# Altium schematic sheet YYB_2015.SchDoc
size A3
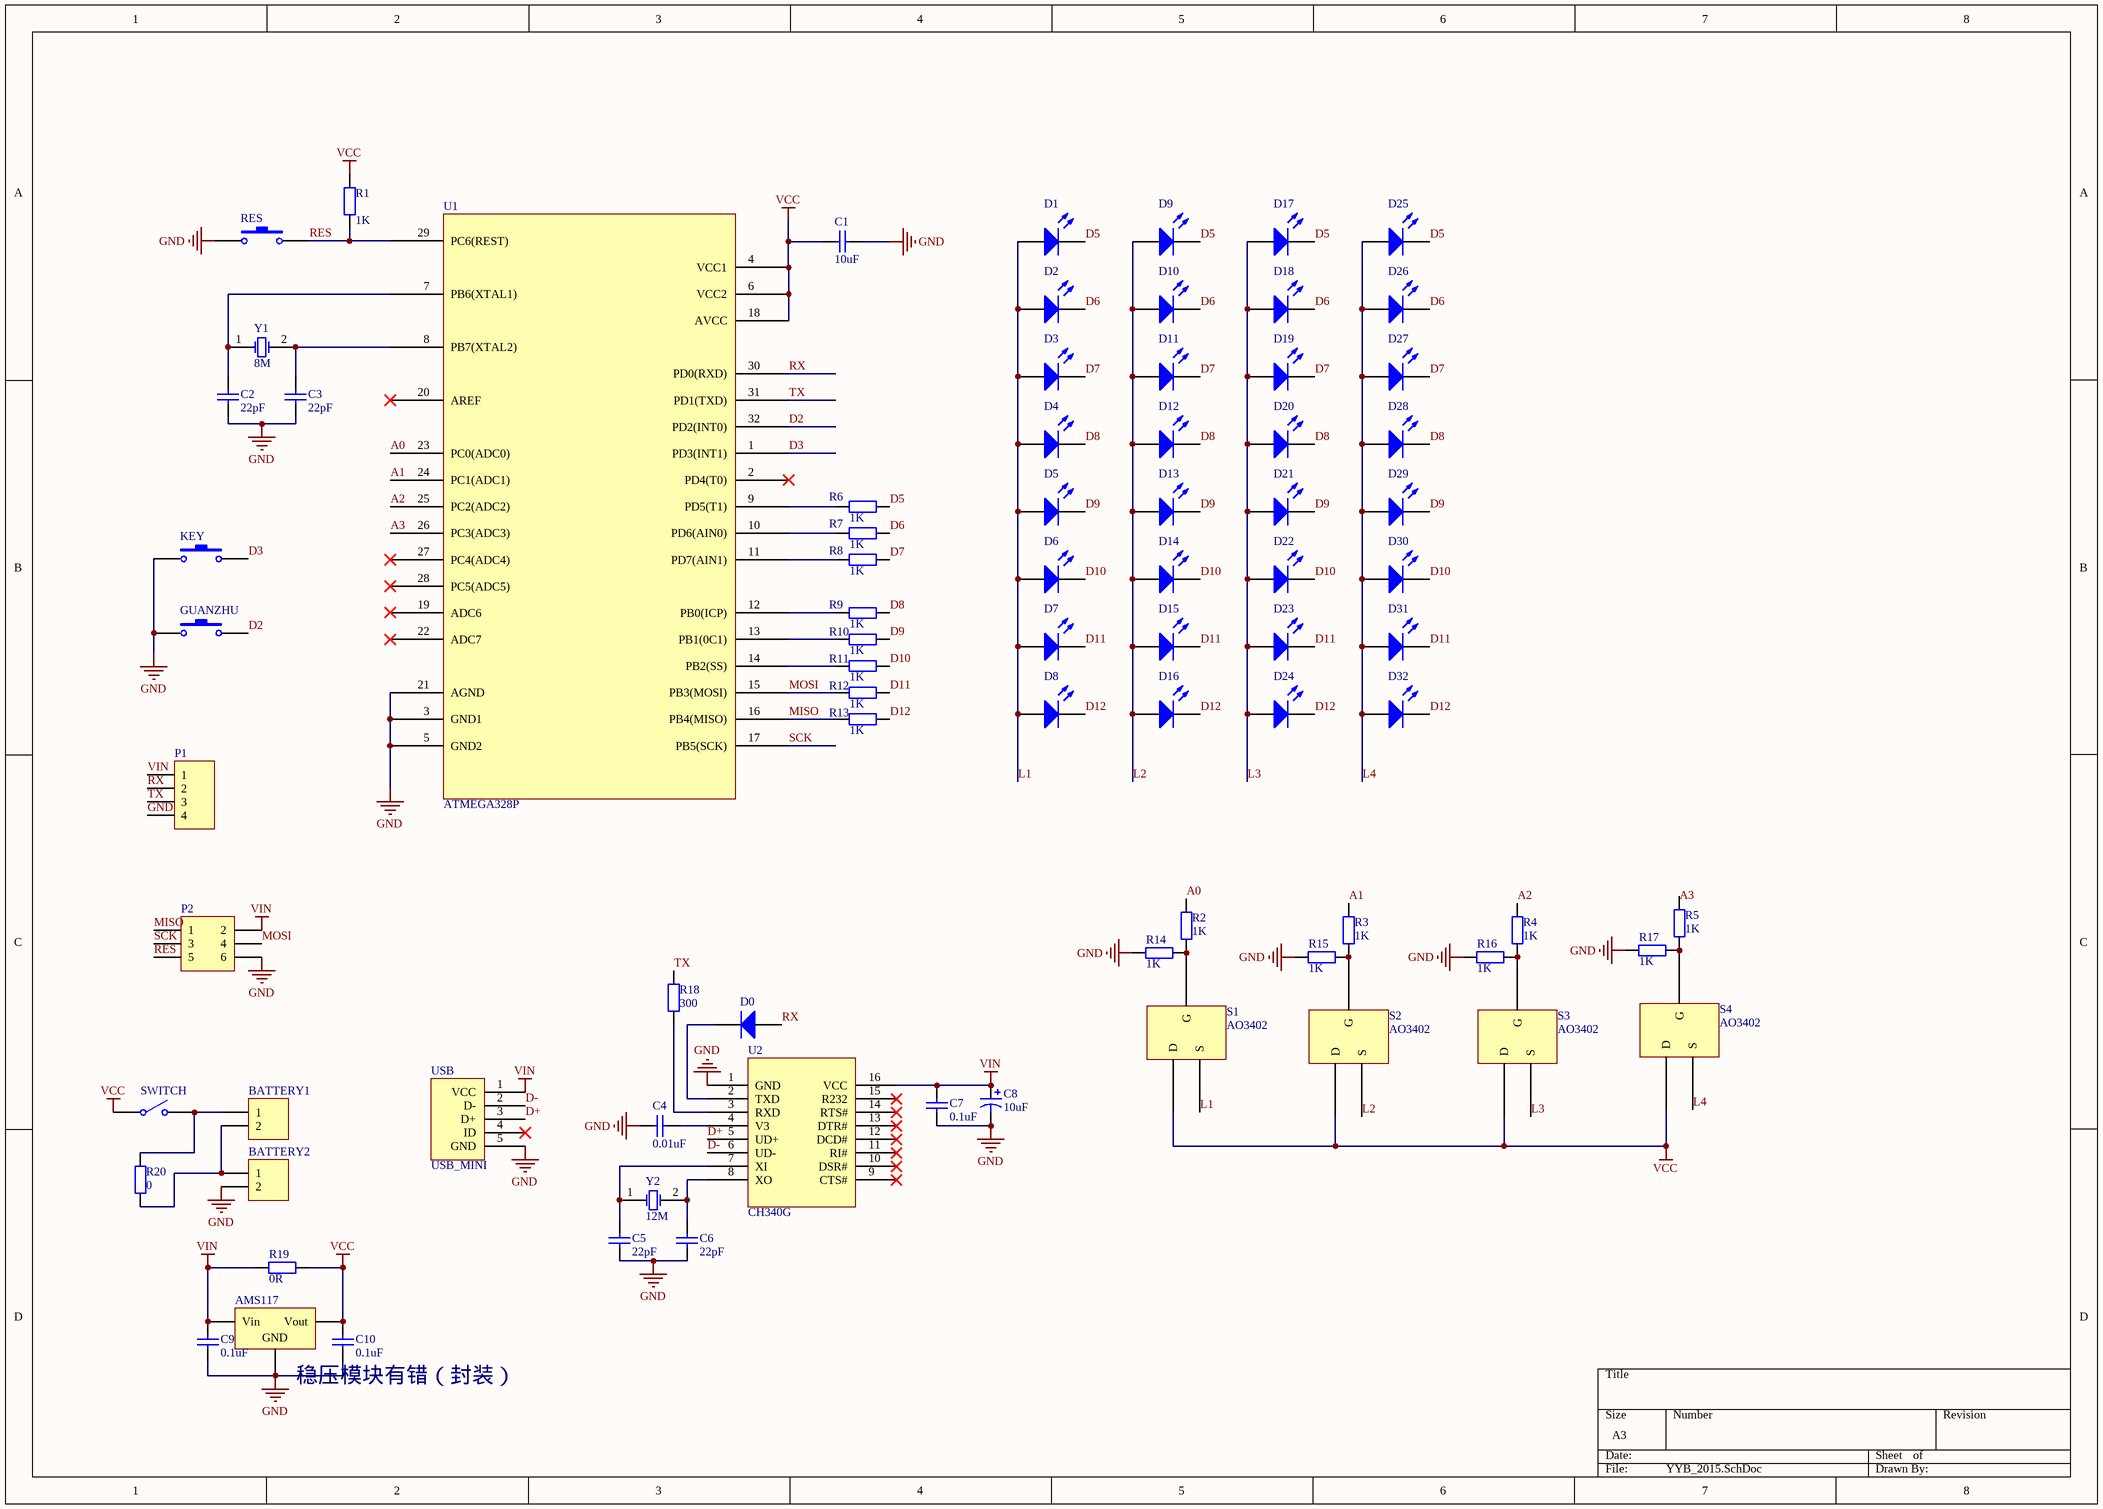
[diagram p0: YYB_2015.SchDoc]

## Parts
AMS117  AMS117  [SOT223_M]  (value not drawn)
BATTERY1  Header 2  [PCBComponent_1 - duplicate1]  (value not drawn)
BATTERY2  Header 2  [PCBComponent_1 - duplicate1]  (value not drawn)
C1  value 10uF  [RES_0603]  (hidden comment: Cap)
C2  value 22pF  [RES_0603]  (hidden comment: Cap)
C3  value 22pF  [RES_0603]  (hidden comment: Cap)
C4  value 0.01uF  [RES_0603]  (hidden comment: Cap)
C5  value 22pF  [RES_0603]  (hidden comment: Cap)
C6  value 22pF  [RES_0603]  (hidden comment: Cap)
C7  value 0.1uF  [RES_0603]  (hidden comment: Cap)
C8  value 10uF  [10uf]  (hidden comment: Cap Pol1)
C9  value 0.1uF  [RES_0603]  (hidden comment: Cap)
C10  value 0.1uF  [RES_0603]  (hidden comment: Cap)
D0  Diode 1N4003  [MBR0520]  (value not drawn)
D1  LED0  [LED1210]  (value not drawn)
D2  LED0  [LED1210]  (value not drawn)
D3  LED0  [LED1210]  (value not drawn)
D4  LED0  [LED1210]  (value not drawn)
D5  LED0  [LED1210]  (value not drawn)
D6  LED0  [LED1210]  (value not drawn)
D7  LED0  [LED1210]  (value not drawn)
D8  LED0  [LED1210]  (value not drawn)
D9  LED0  [LED1210]  (value not drawn)
D10  LED0  [LED1210]  (value not drawn)
D11  LED0  [LED1210]  (value not drawn)
D12  LED0  [LED1210]  (value not drawn)
D13  LED0  [LED1210]  (value not drawn)
D14  LED0  [LED1210]  (value not drawn)
D15  LED0  [LED1210]  (value not drawn)
D16  LED0  [LED1210]  (value not drawn)
D17  LED0  [LED1210]  (value not drawn)
D18  LED0  [LED1210]  (value not drawn)
D19  LED0  [LED1210]  (value not drawn)
D20  LED0  [LED1210]  (value not drawn)
D21  LED0  [LED1210]  (value not drawn)
D22  LED0  [LED1210]  (value not drawn)
D23  LED0  [LED1210]  (value not drawn)
D24  LED0  [LED1210]  (value not drawn)
D25  LED0  [LED1210]  (value not drawn)
D26  LED0  [LED1210]  (value not drawn)
D27  LED0  [LED1210]  (value not drawn)
D28  LED0  [LED1210]  (value not drawn)
D29  LED0  [LED1210]  (value not drawn)
D30  LED0  [LED1210]  (value not drawn)
D31  LED0  [LED1210]  (value not drawn)
D32  LED0  [LED1210]  (value not drawn)
GUANZHU  SW-PB  [GUNZHU]  (value not drawn)
KEY  SW-PB  [KEY]  (value not drawn)
P1  Header 4  [HDR1X4]  (value not drawn)
P2  Header 3X2  [HDR2X3]  (value not drawn)
R1  value 1K  [RES_0603]  (hidden comment: Res2)
R2  value 1K  [RES_0603]  (hidden comment: Res2)
R3  value 1K  [RES_0603]  (hidden comment: Res2)
R4  value 1K  [RES_0603]  (hidden comment: Res2)
R5  value 1K  [RES_0603]  (hidden comment: Res2)
R6  value 1K  [RES_0603]  (hidden comment: Res2)
R7  value 1K  [RES_0603]  (hidden comment: Res2)
R8  value 1K  [RES_0603]  (hidden comment: Res2)
R9  value 1K  [RES_0603]  (hidden comment: Res2)
R10  value 1K  [RES_0603]  (hidden comment: Res2)
R11  value 1K  [RES_0603]  (hidden comment: Res2)
R12  value 1K  [RES_0603]  (hidden comment: Res2)
R13  value 1K  [RES_0603]  (hidden comment: Res2)
R14  value 1K  [RES_0603]  (hidden comment: Res2)
R15  value 1K  [RES_0603]  (hidden comment: Res2)
R16  value 1K  [RES_0603]  (hidden comment: Res2)
R17  value 1K  [RES_0603]  (hidden comment: Res2)
R18  value 300  [RES_0603]  (hidden comment: Res2)
R19  value 0R  [RES_0603]  (hidden comment: Res2)
R20  value 0  [RES_0603]  (hidden comment: Res2)
RES  SW-PB  [KEY]  (value not drawn)
S1  AO3402  [SOT23_M]
S2  AO3402  [SOT23_M]
S3  AO3402  [SOT23_M]
S4  AO3402  [SOT23_M]
SWITCH  SW-SPST  [SPST-2]  (value not drawn)
U1  ATMEGA328P  [328p]
U2  CH340G  [SO-16_N]
USB  USB_MINI  [USB_Micro]
Y1  8M  [XTAL_8M]
Y2  12M  [XTAL32_25]

## Nets
GND: AMS117.2(GND) BATTERY2.2 C1.2 C2.1 C3.1 C4.2 C5.1 C6.1 C7.1 C8.2 C9.1 C10.1 GUANZHU.1 KEY.1 P1.4 P2.6 R14.2 R15.2 R16.2 R17.2 RES.1 U1.3(GND1) U1.5(GND2) U1.21(AGND) U2.1(GND) USB.5(GND)
VCC: AMS117.3(Vout) C1.1 C10.2 R1.2 R19.2 S1.1(D) S2.1(D) S3.1(D) S4.1(D) SWITCH.1(COMMON) U1.4(VCC1) U1.6(VCC2) U1.18(AVCC)
VIN: AMS117.1(Vin) C7.2 C8.1 C9.2 P1.1 P2.2 R19.1 U2.16(VCC) USB.1(VCC)
A0: R2.2 U1.23(PC0(ADC0))
A1: R3.2 U1.24(PC1(ADC1))
A2: R4.2 U1.25(PC2(ADC2))
A3: U1.26(PC3(ADC3))
D2: GUANZHU.2 U1.32(PD2(INT0))
D3: KEY.2 U1.1(PD3(INT1))
D5: D1.2(K) D9.2(K) D17.2(K) D25.2(K) R6.2
D6: D2.2(K) D10.2(K) D18.2(K) D26.2(K) R7.2
D7: D3.2(K) D11.2(K) D19.2(K) D27.2(K) R8.2
D8: D4.2(K) D12.2(K) D20.2(K) D28.2(K) R9.2
D9: D5.2(K) D13.2(K) D21.2(K) D29.2(K) R10.2
D10: D6.2(K) D14.2(K) D22.2(K) D30.2(K) R11.2
D11: D7.2(K) D15.2(K) D23.2(K) D31.2(K) R12.2
D12: D8.2(K) D16.2(K) D24.2(K) D32.2(K) R13.2
D+: U2.5(UD+) USB.3(D+)
D-: U2.6(UD-) USB.2(D-)
L1: D1.1(A) D2.1(A) D3.1(A) D4.1(A) D5.1(A) D6.1(A) D7.1(A) D8.1(A) S1.2(S)
L2: D9.1(A) D10.1(A) D11.1(A) D12.1(A) D13.1(A) D14.1(A) D15.1(A) D16.1(A) S2.2(S)
L3: D17.1(A) D18.1(A) D19.1(A) D20.1(A) D21.1(A) D22.1(A) D23.1(A) D24.1(A) S3.2(S)
L4: D25.1(A) D26.1(A) D27.1(A) D28.1(A) D29.1(A) D30.1(A) D31.1(A) D32.1(A) S4.2(S)
MISO: P2.1 R13.1 U1.16(PB4(MISO))
MOSI: P2.4 R12.1 U1.15(PB3(MOSI))
RES: P2.5 R1.1 RES.2 U1.29(PC6(REST))
RX: D0.1(A) P1.2 U1.30(PD0(RXD))
SCK: P2.3 U1.17(PB5(SCK))
TX: P1.3 R18.1 U1.31(PD1(TXD))
NetBATTERY1_1: BATTERY1.1 R20.1 SWITCH.2(NO)
NetBATTERY1_2: BATTERY1.2 BATTERY2.1 R20.2
NetC2_2: C2.2 U1.7(PB6(XTAL1)) Y1.1(OSC1)
NetC3_2: C3.2 U1.8(PB7(XTAL2)) Y1.2(OSC2)
NetC4_1: C4.1 U2.4(V3)
NetC5_2: C5.2 U2.7(XI) Y2.1(OSC1)
NetC6_2: C6.2 U2.8(XO) Y2.2(OSC2)
NetD0_2: D0.2(K) U2.2(TXD)
NetR2_1: R2.1 R14.1 S1.3(G)
NetR3_1: R3.1 R15.1 S2.3(G)
NetR4_1: R4.1 R16.1 S3.3(G)
NetR5_1: R5.1 R17.1 S4.3(G)
NetR6_1: R6.1 U1.9(PD5(T1))
NetR7_1: R7.1 U1.10(PD6(AIN0))
NetR8_1: R8.1 U1.11(PD7(AIN1))
NetR9_1: R9.1 U1.12(PB0(ICP))
NetR10_1: R10.1 U1.13(PB1(0C1))
NetR11_1: R11.1 U1.14(PB2(SS))
NetR18_2: R18.2 U2.3(RXD)

Not connected (* = marked no-connect by the designer): R5 2; U1 2(PD4(T0))* 19(ADC6)* 20(AREF)* 22(ADC7)* 27(PC4(ADC4))* 28(PC5(ADC5))*; U2 9(CTS#)* 10(DSR#)* 11(RI#)* 12(DCD#)* 13(DTR#)* 14(RTS#)* 15(R232)*; USB 4(ID)*

## Notes on the sheet
- 稳压模块有错（封装）
- Labels drawn without touching a wire or pin: A3

## Library data of the parts
AMS117 = Volt Reg: Voltage Regulator; Published: 24-Mar-1999; LatestRevisionDate: 29-May-2009; LatestRevisionNote: IPC-7351 Footprint Added.; PackageReference: D2PAK; Publisher: Altium Limited; PackageDescription: 3-Pin Transistor Outline Package 2.54 mm Pitch, 15.1 mm Lead Span
BATTERY1 BATTERY2 = Header 2: Header, 2-Pin; LatestRevisionDate: 17-Jul-2002; LatestRevisionNote: Re-released for DXP Platform.; Publisher: Altium Limited
C1-C7 C9 C10 = Cap: Capacitor; Published: 8-Jun-2000; LatestRevisionDate: 17-Jul-2002; LatestRevisionNote: Re-released for DXP Platform.; PackageReference: RAD-0.3; Publisher: Altium Limited; PackageDescription: Radial Cap, Thru-Hole; 2 Leads; 0.3 in Pin Spacing
C8 = Cap Pol1: Polarized Capacitor (Radial); Published: 8-Jun-2000; LatestRevisionDate: 17-Jul-2002; LatestRevisionNote: Re-released for DXP Platform.; PackageReference: RB7.6-15; Publisher: Altium Limited; PackageDescription: Polarized Capacitor (Radial); 2 Leads
D0 = Diode 1N4003: 1 Amp General Purpose Rectifier; Published: 8-Jun-2000; LatestRevisionDate: 17-Jul-2002; LatestRevisionNote: Re-released for DXP Platform.; DatasheetVersion: 1998; PackageVersion: Aug-1999; PackageReference: DO-41; Publisher: Altium Limited; PackageDescription: Diode, Axial; Body 5.2 x 2.7 mm (LxDia. max), Lead Dia. 0.86 mm (max); Code_JEDEC: DO-204-AL; ComponentLink1Description: Manufacturer Link; ComponentLink1URL: http://www.fairchildsemi.com/; ComponentLink2Description: Datasheet; ComponentLink2URL: http://www.fairchildsemi.com/ds/1N%2F1N4001.pdf
D1-D32 = LED0: Typical INFRARED GaAs LED; Published: 8-Jun-2000; LatestRevisionDate: 08-Jul-2005; LatestRevisionNote: Mech Layer 1 removed.; PackageReference: LED-0; Publisher: Altium Limited; PackageDescription: LED; 2 Leads
GUANZHU KEY RES = SW-PB: Switch; Published: 24-Mar-1999; LatestRevisionDate: 17-Jul-2002; LatestRevisionNote: Re-released for DXP Platform.; PackageReference: SPST-2; Publisher: Altium Limited; PackageDescription: Switch; 2 Leads
P1 = Header 4: Header, 4-Pin; LatestRevisionDate: 17-Jul-2002; LatestRevisionNote: Re-released for DXP Platform.; Publisher: Altium Limited
P2 = Header 3X2: Header, 3-Pin, Dual row; LatestRevisionDate: 17-Jul-2002; LatestRevisionNote: Re-released for DXP Platform.; Publisher: Altium Limited
R1-R20 = Res2: Resistor; Published: 8-Jun-2000; LatestRevisionDate: 17-Jul-2002; LatestRevisionNote: Re-released for DXP Platform.; PackageReference: AXIAL-0.4; Publisher: Altium Limited; PackageDescription: Axial Device, Thru-Hole; 2 Leads; 0.4 in Pin Spacing
SWITCH = SW-SPST: Single-Pole, Single-Throw Switch; Published: 24-Mar-1999; LatestRevisionDate: 17-Jul-2002; LatestRevisionNote: Re-released for DXP Platform.; PackageReference: SPST-2; Publisher: Altium Limited; PackageDescription: Switch; 2 Leads
Y1 Y2 = XTAL: Crystal Oscillator; Published: 8-Jun-2000; LatestRevisionDate: 17-Jul-2002; LatestRevisionNote: Re-released for DXP Platform.; PackageReference: R38; Publisher: Altium Limited; PackageDescription: Crystal, Thru-Hole; 2 Leads; Body 3.1 x 8.2 mm (Dia.xH)